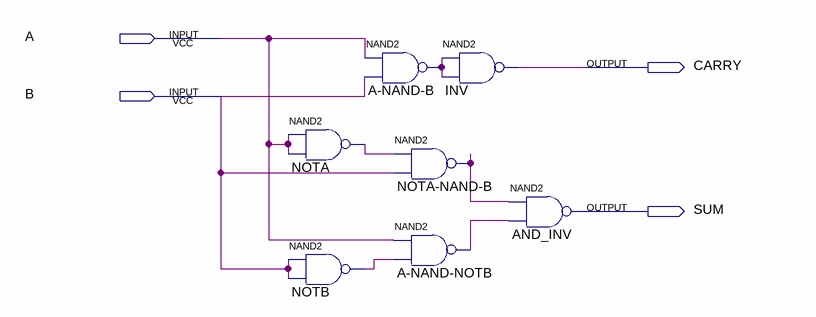
[diagram p0: schematic sheet]
// Quartus schematic HalfAdder.bdf as structural Verilog: 7 symbols, 4 pins
module HalfAdder (
  input  A,
  input  B,
  output CARRY,
  output SUM
);

  wire A_NAND_B_out, A_NAND_NOTB_out, NOTA_NAND_B_out, NOTA_out, NOTB_out;

  nand NOTA (NOTA_out, A, A);
  nand NOTB (NOTB_out, B, B);
  nand \A-NAND-B  (A_NAND_B_out, A, B);
  nand \NOTA-NAND-B  (NOTA_NAND_B_out, NOTA_out, B);
  nand \A-NAND-NOTB  (A_NAND_NOTB_out, A, NOTB_out);
  nand INV (CARRY, A_NAND_B_out, A_NAND_B_out);
  nand AND_INV (SUM, NOTA_NAND_B_out, A_NAND_NOTB_out);
endmodule
